# EAGLE schematic electronics (EAGLE 9.6.0)
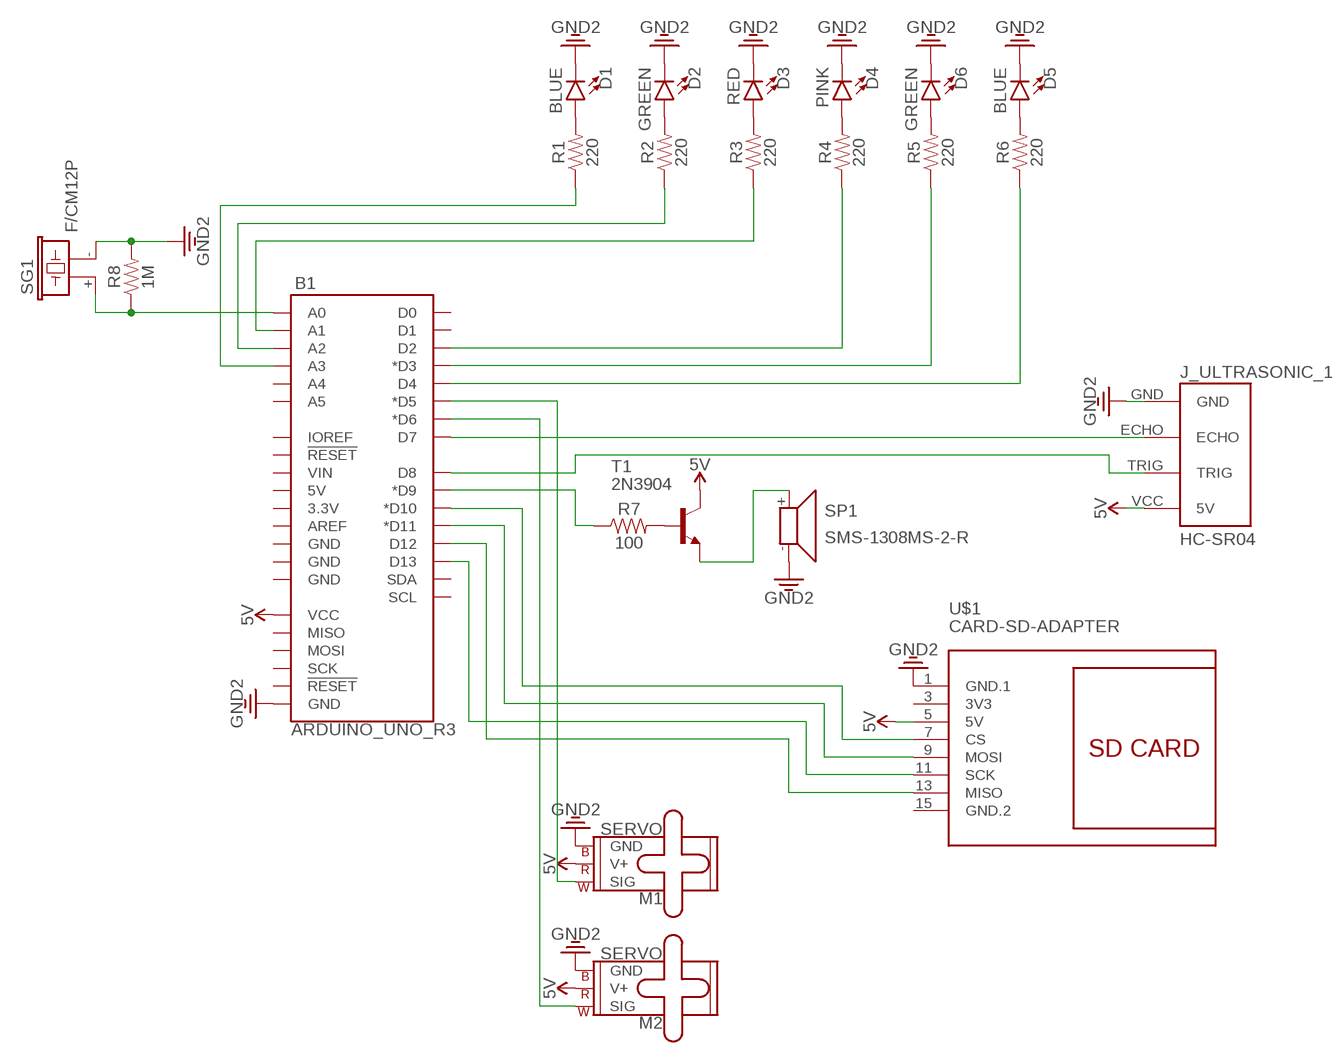
[diagram p0: schematic, sheet 1]

## Parts
B1  ARDUINO_UNO_R3  [ARDUINO_R3]
D1  BLUE  LED-BLUE0603  [LED-0603]
D2  GREEN  LED-GREEN0603  [LED-0603]
D3  RED  LED-RED0603  [LED-0603]
D4  PINK  LED-PINK1206  [LED-1206]
D5  BLUE  LED-BLUE0603  [LED-0603]
D6  GREEN  LED-GREEN0603  [LED-0603]
J_ULTRASONIC_1  HC-SR04  [HC-SR04_FOOTPRINT]
M1  SERVO  [1X03]
M2  SERVO  [1X03]
R1  220  220OHM-0603-1/10W-1%  [0603]
R2  220  220OHM-0603-1/10W-1%  [0603]
R3  220  220OHM-0603-1/10W-1%  [0603]
R4  220  220OHM-0603-1/10W-1%  [0603]
R5  220  220OHM-0603-1/10W-1%  [0603]
R6  220  220OHM-0603-1/10W-1%  [0603]
R7  100  100OHM-0603-1/4W-5%  [0603]
R8  1M  1MOHM-0603-1/4W-5%  [0603]
SG1  F/CM12P  [F/CM12P]
SP1  SMS-1308MS-2-R  [SMS-1308MS-2-R]
T1  2N3904  [TO92]
U$1  CARD-SD-ADAPTER  [CARD-SD-ADAPTER]

## Nets
3.3V: B1.GND@1(GND) D1.C D2.C D3.C D4.C D5.C D6.C J_ULTRASONIC_1.GND M1.3(GND) M2.3(GND) R8.2 SG1.- SP1.- U$1.1(GND.1) ; supply symbol labelled GND2
5V: B1.VCC J_ULTRASONIC_1.VCC(5V) M1.2(V+) M2.2(V+) T1.1(C) U$1.5(5V)
N$1: D1.A R1.2
N$2: D2.A R2.2
N$3: D3.A R3.2
N$4: D4.A R4.2
N$5: D6.A R5.2
N$6: D5.A R6.2
N$7: B1.A1 R3.1
N$8: B1.A2 R2.1
N$9: B1.A3 R1.1
N$10: B1.D2 R4.1
N$11: B1.D3(*D3) R5.1
N$12: B1.D4 R6.1
N$13: B1.D10(*D10) U$1.7(CS)
N$14: R7.2 T1.2(B)
N$15: SP1.+ T1.3(E)
N$16: B1.D9(*D9) R7.1
N$17: B1.A0 R8.1 SG1.+
N$18: B1.D7 J_ULTRASONIC_1.ECHO
N$19: B1.D8 J_ULTRASONIC_1.TRIG
N$20: B1.D5(*D5) M1.1(SIG)
N$21: B1.D6(*D6) M2.1(SIG)
N$22: B1.D11(*D11) U$1.9(MOSI)
N$23: B1.D12 U$1.13(MISO)
N$24: B1.D13 U$1.11(SCK)
Unconnected: B1.3.3V B1.5V B1.A4 B1.A5 B1.AREF B1.D0 B1.D1 B1.GND@2(GND) B1.GND@3(GND) B1.GND@4(GND) B1.IOREF B1.MISO B1.MOSI B1.RESET@1(!RESET!) B1.RESET@2(!RESET!) B1.SCK B1.SCL B1.SDA B1.VIN

## Power pins joined to a net without a drawn wire
3V3: U$1.3(3V3)
GND.2: U$1.15(GND.2)

## Library data of the parts
B1 = SparkFun-Boards:ARDUINO_UNO_R3: Arduino R3 Footprint with SPI header Arduino Uno R3 Compatible Footprint. Matches PCB size of the original board. SparkFun Products: SAMD21 Dev Breakout <https://www.sparkfun.com/products/13672> RedBoard <https://www.sparkfun.com/products/12757> R3 Stackable Headers <https://www.sparkfun.com/products/11417>
D1 D5 = SparkFun-LED:LED-BLUE: Blue SMD LED Used in manufacturing of various products at SparkFun Packages: 0603 - SMD 0603 package [Product Link] <http://www.digikey.com/product-detail/en/SMLE12BC7TT86/511-1589-2-ND/1641808> 1206 - SMD1206 package [Product Link] <http://www.digikey.com/product-detail/en/lite-on-inc/LTST-C150TBKT/160-1643-1-ND/573584> SparkFun Products: ESP8266 Thing-Dev Board <https://www.sparkfun.com/products/13711> RedBoard <https://www.sparkfun.com/products/12757>; PROD_ID: DIO-08575
D2 D6 = SparkFun-LED:LED-GREEN: Green SMD LED Used in manufacturing of various products at SparkFun Packages: 0603 - SMD 0603 package [Product Link] <http://www.futureelectronics.com/en/technologies/semiconductors/optoelectronics/leds/Pages/9894312-LTST-C190GKT.aspx?CrossPart=HSMG-C190&IM=0> LilyPad 1206 - SMD1206 LilyPad package [Product Link] <http://www.futureelectronics.com/en/Technologies/Product.aspx?ProductID=IN150NGHARVATEKCORPORATION2049943&IM=0> 1206 - SMD1206 package [Product Link] <http://www.futureelectronics.com/en/technologies/semiconductors/optoelectronics/leds/Pages/8315665-LTST-C150KGKT.aspx?IM=0> 1206 Bottom Mount -SMD 1206 Bottom Mount [Product Link] <http://www.digikey.com/product-detail/en/lite-on-inc/LTST-C230KGKT/160-1456-1-ND/386854> SparkFun Products: Pro Mini 328 -5V <https://www.sparkfun.com/products/821> RedBoard <https://www.sparkfun.com/products/12757> MP3 Trigger <https://www.sparkfun.com/products/13720> Makey Makey <https://www.sparkfun.com/products/11076>; PROD_ID: DIO-00821
D3 = SparkFun-LED:LED-RED: Red SMD LED Used in manufacturing of most products at SparkFun Packages: 0603 - SMD 0603 package [Product Link] <http://docs.avagotech.com/docs/AV02-0551EN> 0603 SMART - SMD 0603 SMART package ( more efficient and expensive)[Product Link] <http://www.osram-os.com/Graphics/XPic2/00077099_0.pdf> 1206 - SMD1206 package [Product Link] <https://www.sparkfun.com/datasheets/DevTools/LilyPad/Q150OVS4.pdff> SparkFun Products: Pro Mini 328 -5V <https://www.sparkfun.com/products/821> RedBoard <https://www.sparkfun.com/products/12757> IOIO-OTG <https://www.sparkfun.com/products/13613>; PROD_ID: DIO-00819
D4 = SparkFun-LED:LED-PINK: Pink SMD LED Used in manufacturing of various products at SparkFun Packages: 0603 - SMD 0603 package [Product Link] <http://cdn.sparkfun.com/datasheets/Components/General/S1206PKSBJC.pdf> SparkFun Products: LilyPad LED Pink <https://www.sparkfun.com/products/10962>; PROD_ID: DIO-10415
J_ULTRASONIC_1 = ultrasonic:HC-SR04: Ultrasonic Sensor HC-SR04
M1 M2 = elektro:SERVO: Servo Motor 3-pin connector for a standard servo motor (voltage supply, ground, and control signal.) SparkFun Products Servo - Generic (Sub-Micro Size) <https://www.sparkfun.com/products/9065> (ROB-09065) Servo - Generic High Torque Continuous Rotation (Standard Size) <https://www.sparkfun.com/products/9347> (ROB-09347) Servo - Generic High Torque (Standard Size) <https://www.sparkfun.com/products/11965> (ROB-11965)
R1-R6 = SparkFun-Resistors:220OHM: 220Ω resistor A resistor is a passive two-terminal electrical component that implements electrical resistance as a circuit element. Resistors act to reduce current flow, and, at the same time, act to lower voltage levels within circuits. - Wikipedia; PROD_ID: RES-07861
R7 = SparkFun-Resistors:100OHM: 100Ω resistor A resistor is a passive two-terminal electrical component that implements electrical resistance as a circuit element. Resistors act to reduce current flow, and, at the same time, act to lower voltage levels within circuits. - Wikipedia; PROD_ID: RES-12438
R8 = SparkFun-Resistors:1MOHM: 1MΩ resistor A resistor is a passive two-terminal electrical component that implements electrical resistance as a circuit element. Resistors act to reduce current flow, and, at the same time, act to lower voltage levels within circuits. - Wikipedia; PROD_ID: RES-07868
SG1 = buzzer:F/CM12P: BUZZER Source: Buerklin; OC_FARNELL: unknown; OC_NEWARK: unknown
SP1 = speaker:SMS-1308MS-2-R: Speaker 13 x 13mm, 8 Ohm, 0.7W Source: pui audio inc. SMS-1308MS-2-R.pdf
T1 = transistor:2N3904: NPN TRANSISTOR
U$1 = diy-modules:CARD-SD-ADAPTER: Full Size SD Card Adapter Module with onboard 3.3V regulator Guide describing how to use SD card with Arduino is available here: https://www.arduino.cc/en/Reference/SDCardNotes Click here to find device on ebay.com <http://www.ebay.com/sch/sd+card+socket+module>